# Altium schematic sheet MEMCON.SchDoc: XDATA/XROM Memory Map Logic
size A; Organization: Altium Limited; Address1: L3, 12a Rodborough Rd; Address2: Frenchs Forest; Address3: NSW; Address4: Australia 2086; DocumentNumber: 2; SheetNumber: 2; SheetTotal: 2
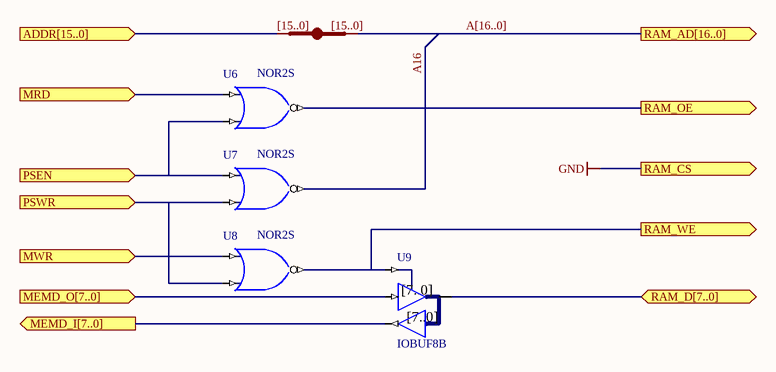
[diagram p0: MEMCON.SchDoc]

## Parts
JB_S?  IndexA: [15..0]  (hidden comment: JB)
U6  NOR2S
U7  NOR2S
U8  NOR2S
U9  IOBUF8B

## Ports
ADDR[15..0] (in), MEMD_I[7..0] (out), MEMD_O[7..0] (in), MRD (in), MWR (in), PSEN (in), PSWR (in), RAM_AD[16..0] (out), RAM_CS (out), RAM_D[7..0] (bidir), RAM_OE (out), RAM_WE (out)

## Nets
GND: port RAM_CS
A16: U7.O
A[16..0]: JB_S?.B[0..0] ; port RAM_AD[16..0]
ADDR[15..0]: JB_S?.A[0..0] ; port ADDR[15..0]
MEMD_I[7..0]: U9.O[7..0] ; port MEMD_I[7..0]
MEMD_O[7..0]: U9.I[7..0] ; port MEMD_O[7..0]
MRD: U6.I0 ; port MRD
MWR: U8.I0 ; port MWR
PSEN: U6.I1 U7.I0 ; port PSEN
PSWR: U7.I1 U8.I1 ; port PSWR
RAM_D[7..0]: U9.IO[7..0] ; port RAM_D[7..0]
RAM_OE: U6.O ; port RAM_OE
RAM_WE: U8.O U9.T ; port RAM_WE

## Buses and harness runs
bus A[16..0] = port RAM_AD[16..0]

## Notes on the sheet
- Title
- Size:
- Date:
- A
- Number:
- Time:
- Revision:
- Sheet
- of
- File:
- (in symbol IOBUF8B) [7..0]

## Library data of the parts
JB_S? = JB: System BUS Joiner; Published: 29-Jan-2004; Publisher: Altium Limited; LastRevisionNo: 1.00.00; HelpURL: CR0118 FPGA Generic Library Guide.pdf#page=296; FunctionalClass: Bus Joiner; IndexB: [15..0]
U6-U8 = NOR2S: 2-Input NOR Gate, Single Pin Version; XilinxEquivalent: NOR2; FunctionalClass: Logic Primitive; PortSize: 2; ArchiveName: GENERIC; VHDLIB_SIM: GENERIC_LIB; Published: 29-Jan-2004; Publisher: Altium Limited; LastRevisionNo: 1.00.00; HelpURL: CR0118 FPGA Generic Library Guide.pdf#page=400; ComponentLink1URL: CR0136 FPGA Logic Primitive Resource Usage.pdf#page=139; ComponentLink1Description: Core &Resource Usage; SubClass: NOR; PortStyle: Single Pin Version
U9 = IOBUF8B: 8-Bit Input/Output Buffer, Bus Version; SubClass: IOBUF; Enable: Low; Control: Common Control T; PortSize: 8; ArchiveName: GENERIC; VHDLIB_SIM: GENERIC_LIB; Published: 29-Jan-2004; Publisher: Altium Limited; LastRevisionNo: 1.00.00; HelpURL: CR0118 FPGA Generic Library Guide.pdf#page=292; ComponentLink1URL: CR0125 FPGA Buffer Resource Usage.pdf#page=87; ComponentLink1Description: Core &Resource Usage; FunctionalClass: Buffer; PortStyle: Bus Version